# Altium schematic sheet G11_IO_ADC.SCHDOC
size A3; SheetNumber: 0; SheetTotal: 0
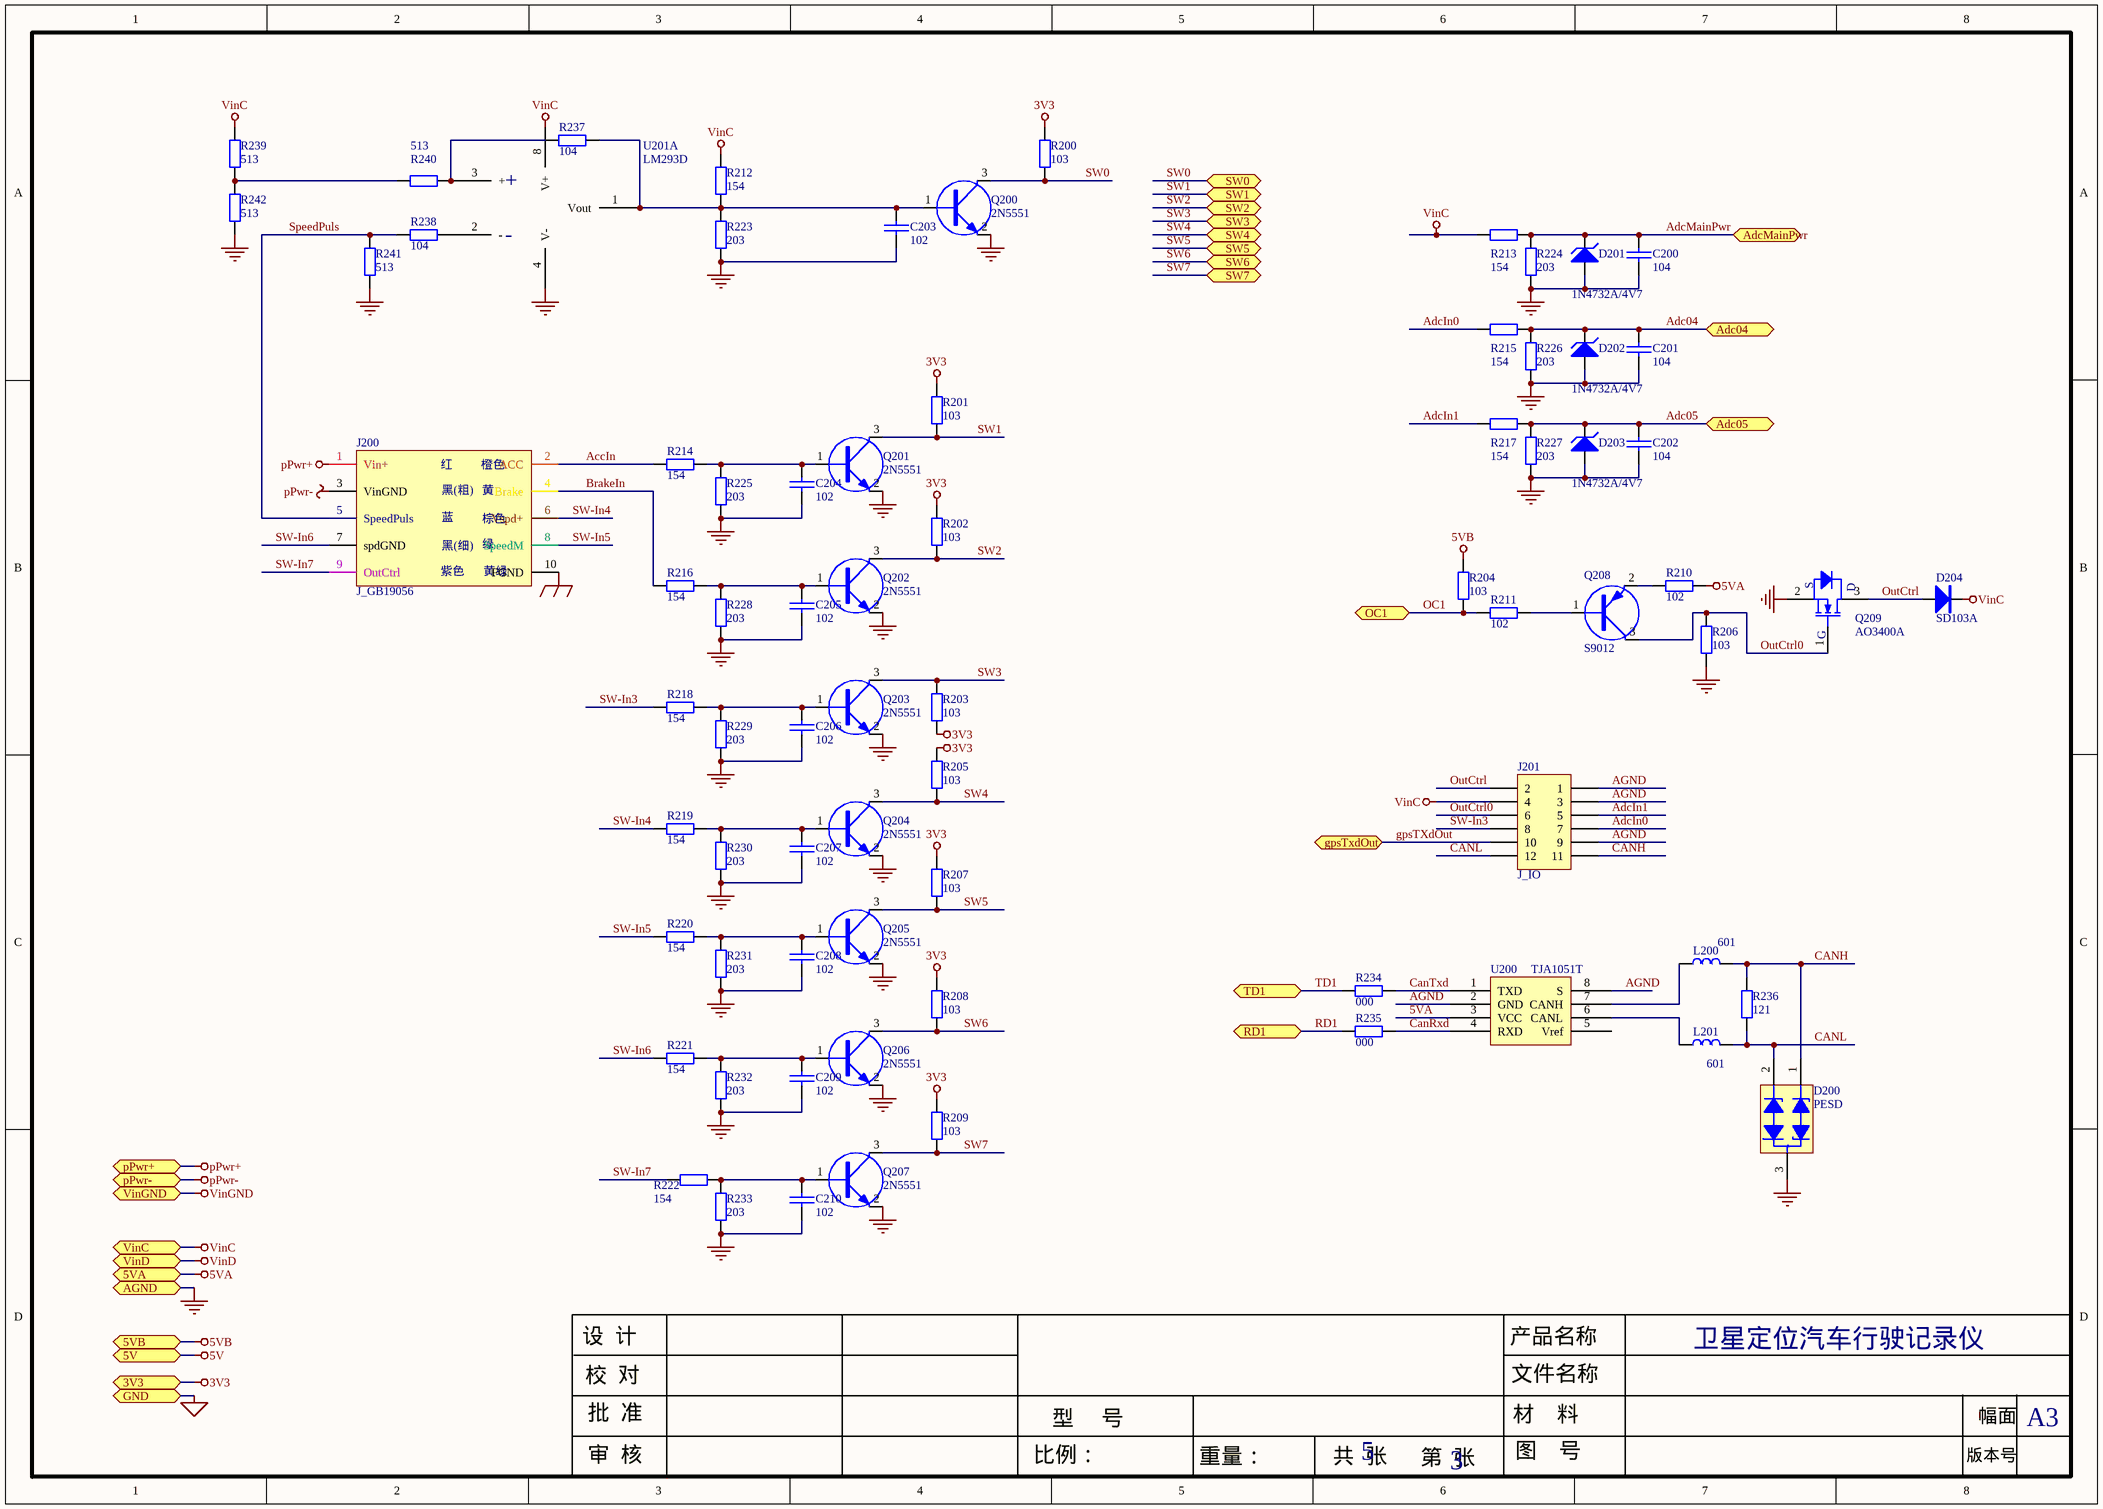
[diagram p0: G11_IO_ADC.SCHDOC]

## Parts
C200  104  [C0603]
C201  104  [C0603]
C202  104  [C0603]
C203  102  [C0603]
C204  102  [C0603]
C205  102  [C0603]
C206  102  [C0603]
C207  102  [C0603]
C208  102  [C0603]
C209  102  [C0603]
C210  102  [C0603]
D200  PESD  [SOT-233]
D201  1N4732A/4V7  [D1206]
D202  1N4732A/4V7  [D1206]
D203  1N4732A/4V7  [D1206]
D204  SD103A  [D1206]
J200  J_GB19056  [HDR5*2-4mm]
J201  J_IO  [HDR2X6-3MM]
L200  601  [0603]
L201  601  [0603]
Q200  2N5551  [SOT-233]
Q201  2N5551  [SOT-233]
Q202  2N5551  [SOT-233]
Q203  2N5551  [SOT-233]
Q204  2N5551  [SOT-233]
Q205  2N5551  [SOT-233]
Q206  2N5551  [SOT-233]
Q207  2N5551  [SOT-233]
Q208  S9012  [SOT-233]
Q209  AO3400A  [SOT-233NM]
R200  103  [R0603]
R201  103  [R0603]
R202  103  [R0603]
R203  103  [R0603]
R204  103  [R0603]
R205  103  [R0603]
R206  103  [R0603]
R207  103  [R0603]
R208  103  [R0603]
R209  103  [R0603]
R210  102  [R0603]
R211  102  [R0603]
R212  154  [R0603]
R213  154  [R0603]
R214  154  [R0603]
R215  154  [R0603]
R216  154  [R0603]
R217  154  [R0603]
R218  154  [R0603]
R219  154  [R0603]
R220  154  [R0603]
R221  154  [R0603]
R222  154  [R0603]
R223  203  [R0603]
R224  203  [R0603]
R225  203  [R0603]
R226  203  [R0603]
R227  203  [R0603]
R228  203  [R0603]
R229  203  [R0603]
R230  203  [R0603]
R231  203  [R0603]
R232  203  [R0603]
R233  203  [R0603]
R234  000  [R0603]
R235  000  [R0603]
R236  121  [R0603]
R237  104  [R0603]
R238  104  [R0603]
R239  513  [R0603]
R240  513  [R0603]
R241  513  [R0603]
R242  513  [R0603]
U200  TJA1051T  [SMD8A]
U201  LM293D  [SMD8A]  (part A of 2)

## Ports
3V3 (bidir), 5V (bidir), 5VA (bidir), 5VB (bidir), Adc04, Adc05, AdcMainPwr, AGND (bidir), GND (bidir), gpsTxdOut (bidir), OC1, pPwr+ (bidir), pPwr- (bidir), RD1, SW0 (bidir), SW1 (bidir), SW2 (bidir), SW3 (bidir), SW4 (bidir), SW5 (bidir), SW6 (bidir), SW7 (bidir), TD1, VinC (bidir), VinD (bidir), VinGND (bidir)

## Nets
3V3: R200.1 R201.1 R202.1 R203.2 R205.1 R207.1 R208.1 R209.1 ; port 3V3
5V: port 5V
5VA: R210.2 U200.3(VCC) ; port 5VA
5VB: R204.1 ; port 5VB
AGND: C200.2 C201.2 C202.2 C203.2 C204.2 C205.2 C206.2 C207.2 C208.2 C209.2 C210.2 D200.3 D201.1(A) D202.1(A) D203.1(A) J201.1 J201.3 J201.9 Q200.2(E) Q201.2(E) Q202.2(E) Q203.2(E) Q204.2(E) Q205.2(E) Q206.2(E) Q207.2(E) Q209.2(S) R206.2 R223.1 R224.1 R225.1 R226.1 R227.1 R228.1 R229.1 R230.1 R231.1 R232.1 R233.1 R241.1 R242.2 U200.2(GND) U200.8(S) U201.4(V-) ; port AGND
FGND: J200.10(FGND)
GND: port GND
pPwr+: J200.1(Vin+) ; port pPwr+
pPwr-: J200.3(VinGND) ; port pPwr-
VinC: D204.2 J201.4 R212.2 R213.1 R239.1 U201.8(V+) ; port VinC
VinD: port VinD
VinGND: port VinGND
AccIn: J200.2(ACC) R214.1
Adc04: C201.1 D202.2(K) R215.2 R226.2 ; port Adc04
Adc05: C202.1 D203.2(K) R217.2 R227.2 ; port Adc05
AdcIn0: J201.7 R215.1
AdcIn1: J201.5 R217.1
AdcMainPwr: C200.1 D201.2(K) R213.2 R224.2 ; port AdcMainPwr
BrakeIn: J200.4(Brake) R216.1
CANH: D200.1 J201.11 L200.2 R236.1
CANL: D200.2 J201.12 L201.2 R236.2
CanRxd: R235.1 U200.4(RXD)
CanTxd: R234.1 U200.1(TXD)
gpsTXdOut: J201.10 ; port gpsTxdOut
OC1: R204.2 R211.1 ; port OC1
OutCtrl: D204.1 J201.2 Q209.3(D)
OutCtrl0: J201.6 Q208.3(E) Q209.1(G) R206.1
RD1: R235.2 ; port RD1
SpeedPuls: J200.5(SpeedPuls) R238.1 R241.2
SW0: Q200.3(C) R200.2 ; port SW0
SW1: Q201.3(C) R201.2 ; port SW1
SW2: Q202.3(C) R202.2 ; port SW2
SW3: Q203.3(C) R203.1 ; port SW3
SW4: Q204.3(C) R205.2 ; port SW4
SW5: Q205.3(C) R207.2 ; port SW5
SW6: Q206.3(C) R208.2 ; port SW6
SW7: Q207.3(C) R209.2 ; port SW7
SW-In3: J201.8 R218.1
SW-In4: J200.6(Vspd+) R219.1
SW-In5: J200.8(SpeedM) R220.1
SW-In6: J200.7(spdGND) R221.2
SW-In7: J200.9(OutCtrl) R222.1
TD1: R234.2 ; port TD1
NetC203_1: C203.1 Q200.1(B) R212.1 R223.2 R237.1 U201.1(Vout)
NetC204_1: C204.1 Q201.1(B) R214.2 R225.2
NetC205_1: C205.1 Q202.1(B) R216.2 R228.2
NetC206_1: C206.1 Q203.1(B) R218.2 R229.2
NetC207_1: C207.1 Q204.1(B) R219.2 R230.2
NetC208_1: C208.1 Q205.1(B) R220.2 R231.2
NetC209_1: C209.1 Q206.1(B) R221.1 R232.2
NetC210_1: C210.1 Q207.1(B) R222.2 R233.2
NetL200_1: L200.1 U200.7(CANH)
NetL201_1: L201.1 U200.6(CANL)
NetQ208_1: Q208.1(B) R211.2
NetQ208_2: Q208.2(C) R210.1
NetR237_2: R237.2 R240.2 U201.3(+)
NetR238_2: R238.2 U201.2(-)
NetR239_2: R239.2 R240.1 R242.1

Not connected (* = marked no-connect by the designer): U200 5(Vref)

## Notes on the sheet
- 设  计
- 校  对
- 产品名称
- 文件名称
- 卫星定位汽车行驶记录仪
- 审  核
- 批  准
- 比例：
- 型     号
- 5
- 材    料
- 图    号
- 版本号
- 幅面
- A3
- 重量：
- 共  张
- 第  张
- 3
- (in symbol J_GB19056) 红; 橙色; 黑(粗); 黄; 蓝; 棕色; 黑(细); 绿; 紫色; 黄绿

## Library data of the parts
C200-C210 = CAP: 直插安规电容; Cap: Cap
D200 = PESD1CAN: 贴片CAN总线保护器
D201-D203 = D Zener: 贴片稳压管; Manufacturer: Generic Components; Class: Discrete; SubClass: Diode - Zener; Published: 08/06/2000; Publisher: Altium Hobart Technology Centre
D204 = DIODE: 贴片二极管; D: Didoe
J200 = J_GB19056: 5.0直插弯头双排座2X5
J201 = Header 6X2: Header, 6-Pin, Dual row; Revision: 17-Jul-2002: Re-released for DXP Platform.; Publisher: Altium Limited
L200 L201 = ChiZhu: 贴片磁珠; Manufacturer: Generic Components; Class: Passive; SubClass: Inductor; Published: 08/06/2000; Publisher: Altium Hobart Technology Centre; Value: 601
Q200-Q207 = 9013: 贴片三极管
Q208 = 9012: 贴片PNP三极管
Q209 = MOSFET-N: 贴片IC,N沟MOS管
R200-R242 = Res2: 贴片电阻; Manufacturer: Generic Components; Class: Passive; SubClass: Resistor; Value: 15K; Published: 08/06/2000; Publisher: Altium Hobart Technology Centre
U200 = TJA1050: 贴片IC
U201 = LM358: 贴片IC